# EAGLE design joypad (EAGLE 9.6.2)
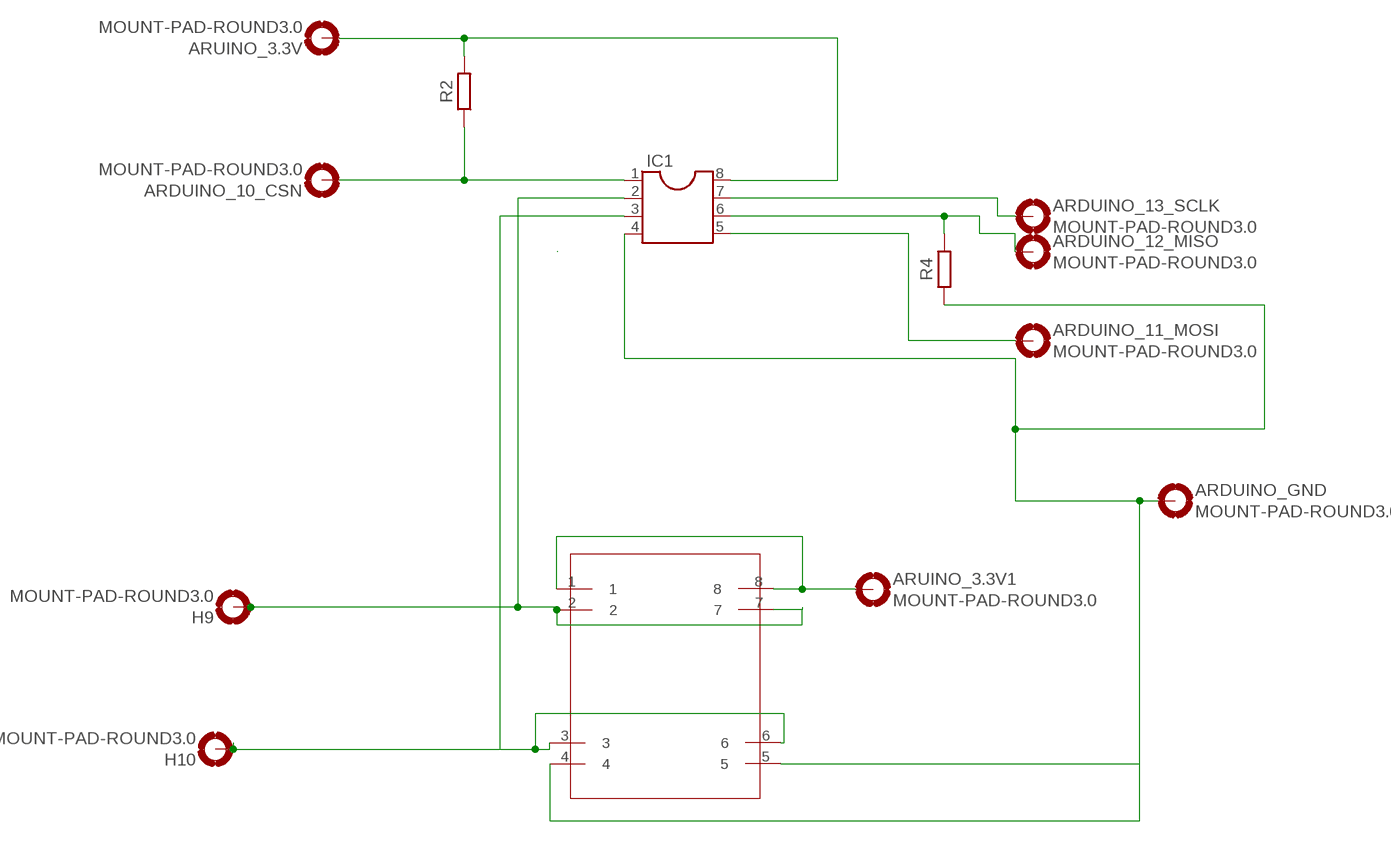
[diagram p0: schematic, sheet 1]

## Parts
ARDUINO_10_CSN  MOUNT-PAD-ROUND3.0  [3,0-PAD]
ARDUINO_11_MOSI  MOUNT-PAD-ROUND3.0  [3,0-PAD]
ARDUINO_12_MISO  MOUNT-PAD-ROUND3.0  [3,0-PAD]
ARDUINO_13_SCLK  MOUNT-PAD-ROUND3.0  [3,0-PAD]
ARDUINO_GND  MOUNT-PAD-ROUND3.0  [3,0-PAD]
ARUINO_3.3V  MOUNT-PAD-ROUND3.0  [3,0-PAD]
ARUINO_3.3V1  MOUNT-PAD-ROUND3.0  [3,0-PAD]
H9  MOUNT-PAD-ROUND3.0  [3,0-PAD]
H10  MOUNT-PAD-ROUND3.0  [3,0-PAD]
IC1  DIL8  [DIL08]
R2  R_AXIAL-7.2MM-PITCH  [RESAD724W46L381D178B]
R4  R_AXIAL-7.2MM-PITCH  [RESAD724W46L381D178B]
U$1  JOYSTICK  [JOYPAD]

## Nets
3.3V: ARUINO_3.3V.B3,0(MOUNT) IC1.8 R2.2
N$1: ARDUINO_10_CSN.B3,0(MOUNT) IC1.1 R2.1
N$4: ARDUINO_13_SCLK.B3,0(MOUNT) IC1.7
N$5: H10.B3,0(MOUNT) IC1.3 U$1.3 U$1.6
N$6: H9.B3,0(MOUNT) IC1.2 U$1.2 U$1.7
N$7: ARDUINO_12_MISO.B3,0(MOUNT) IC1.6 R4.2
N$8: ARDUINO_GND.B3,0(MOUNT) IC1.4 R4.1 U$1.4 U$1.5
N$9: ARDUINO_11_MOSI.B3,0(MOUNT) IC1.5
N$11: ARUINO_3.3V1.B3,0(MOUNT) U$1.1 U$1.8

## Library data of the parts
ARDUINO_10_CSN ARDUINO_11_MOSI ARDUINO_12_MISO ARDUINO_13_SCLK ARDUINO_GND ARUINO_3.3V ARUINO_3.3V1 H9 H10 = holes:MOUNT-PAD-ROUND: MOUNTING PAD, round
IC1 = ic-package:DIL8: Dual In Line / Socket
R2 R4 = Resistor:R: Resistor Fixed - Generic; CATEGORY: Resistor; SUB-CATEGORY: Fixed
U$1 = untitled:JOYSTICK

## Board
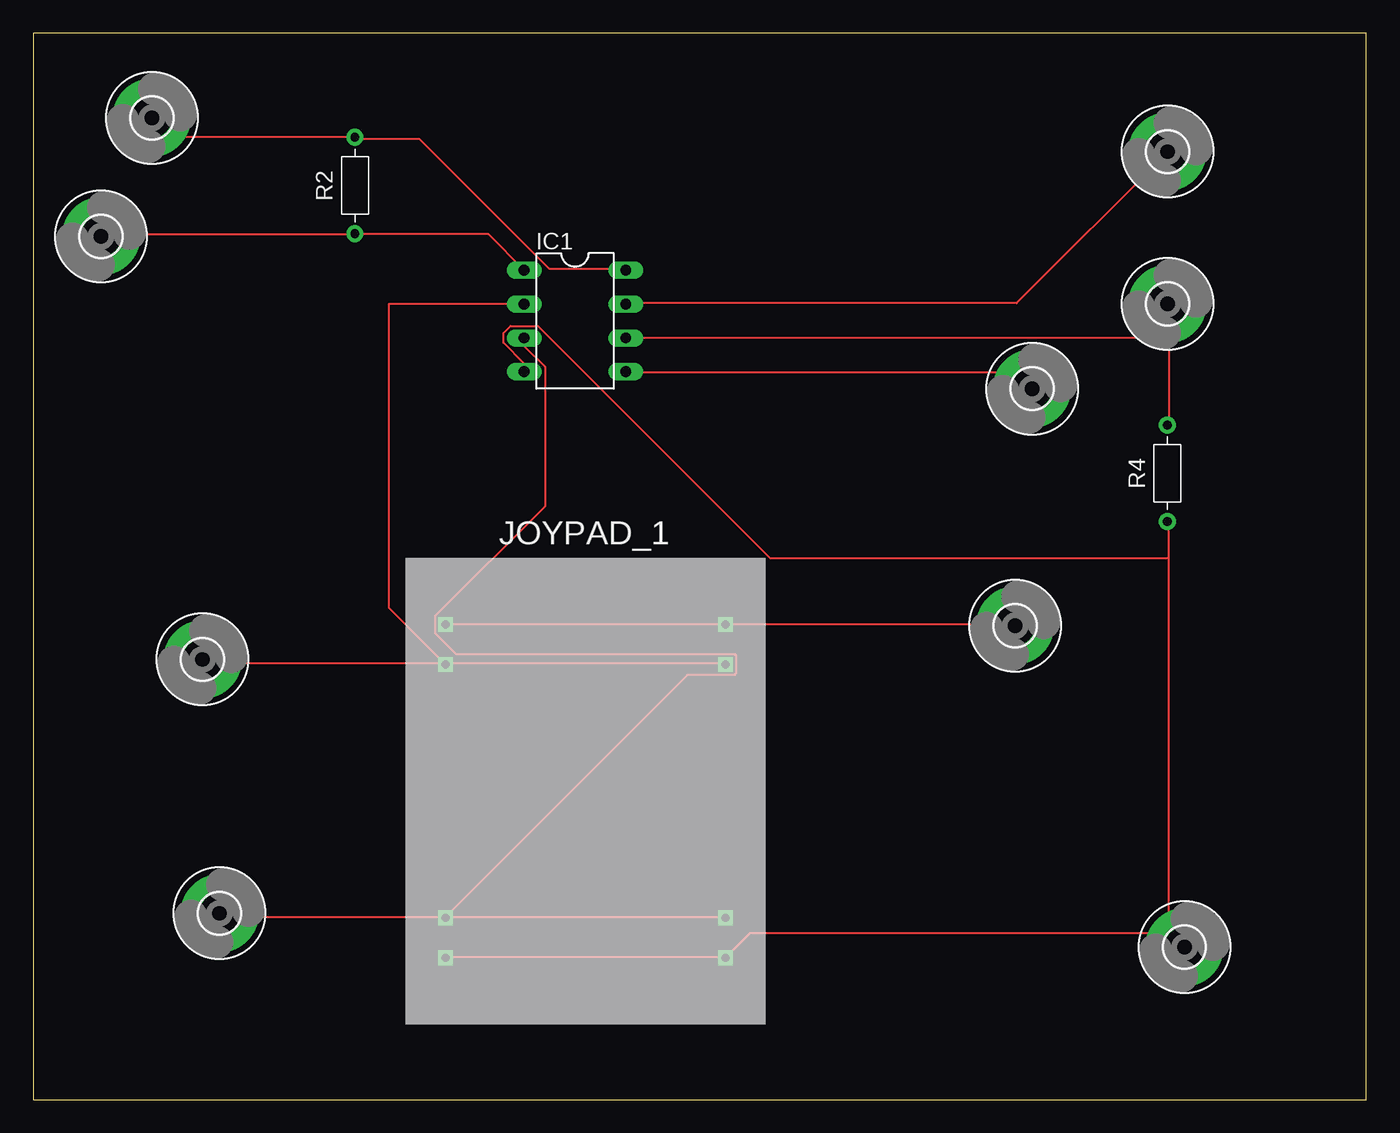
[diagram p1: board, top side]
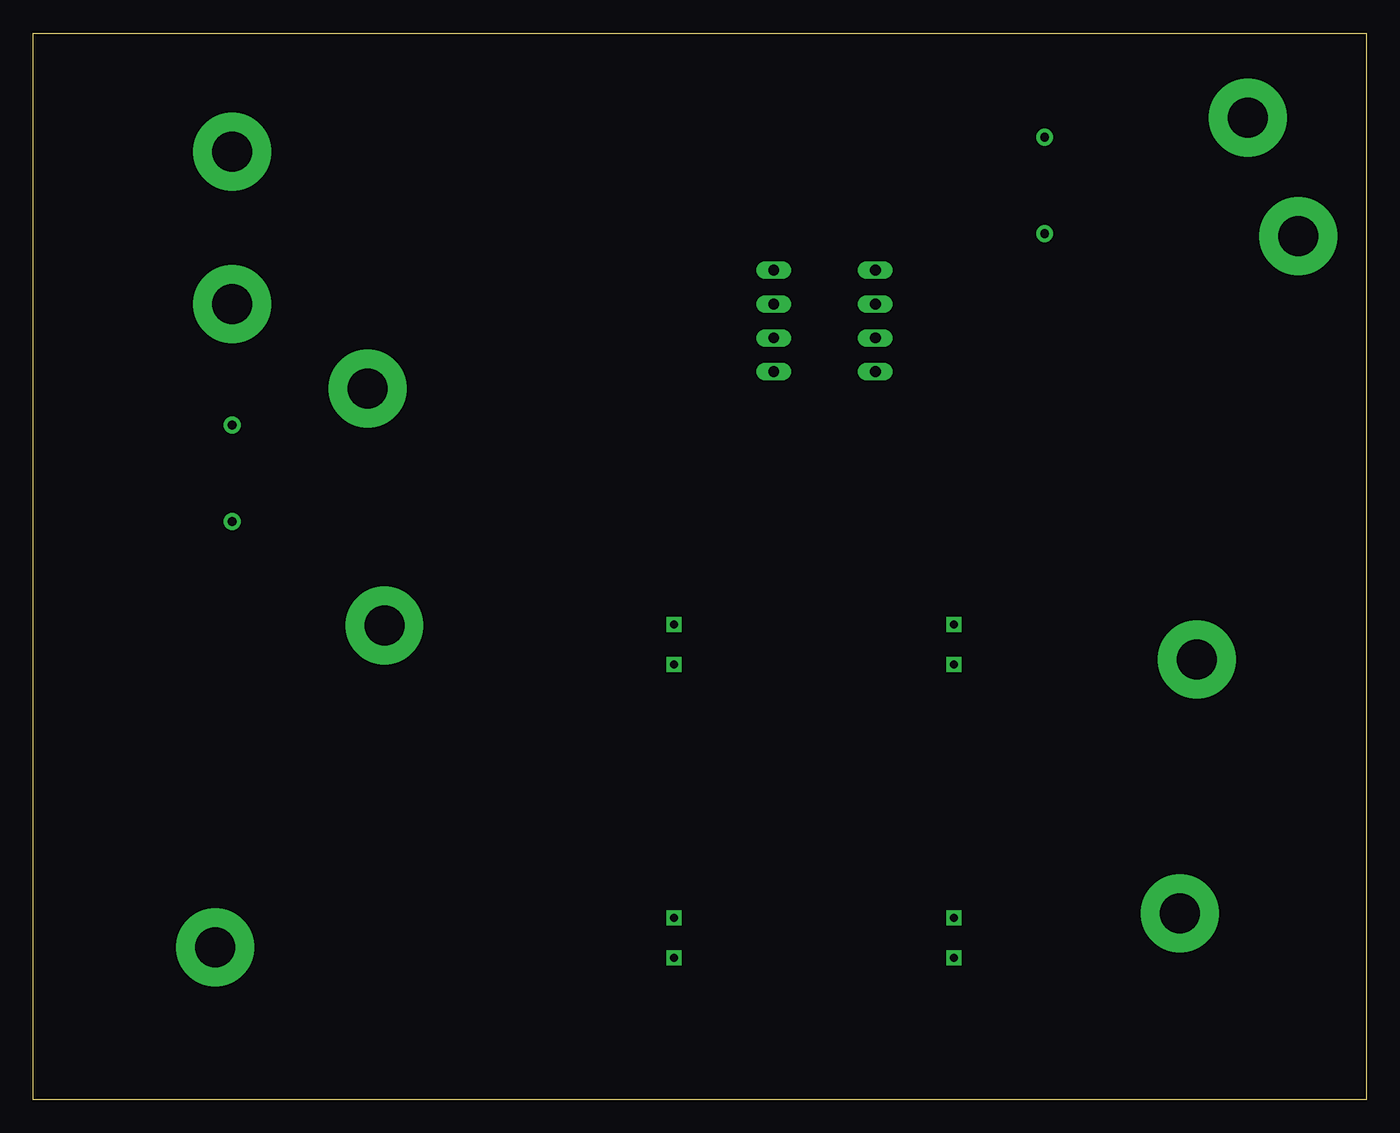
[diagram p2: board, bottom side, seen from below]

Size 100 x 80 mm. Coordinates in mm from the lower left corner, seen from the top.
Outline: 0,0 100,0 100,80 0,80 0,0
Copper layers (1*16): Top 0.035mm / dielectric 1.5mm / Bottom 0.035mm
Design rules "default": minimum track width 6mil, minimum drill 0.35mm, track to track 6mil, track to pad 6mil, pad to pad 6mil, via to via 6mil, smd to smd 6mil, copper to edge 40mil, drill to drill 6mil, minimum pad ring 10mil, minimum via ring 8mil, stop-mask expansion 4mil, vias tented up to drill 0mil, thermal gap 10mil

### Footprints (pad centres in the part's own frame; a part is rotated, then mirrored left to right if it is on the bottom)
3,0-PAD = drill 3 pad 5.842: B3,0 0,0
DIL08 = drill 0.813 long: 1 -3.81,-3.81; 2 -1.27,-3.81; 3 1.27,-3.81; 4 3.81,-3.81; 5 3.81,3.81; 6 1.27,3.81; 7 -1.27,3.81; 8 -3.81,3.81
RESAD724W46L381D178B = drill 0.66 pad 1.26: 1 -3.62,0; 2 3.62,0
JOYPAD = drill 0.6 square: 1 3,-5; 2 3,-8; 3 3,-27; 4 3,-30; 5 24,-30; 6 24,-27; 7 24,-8; 8 24,-5

### Placement (x,y rotation side)
ARDUINO_10_CSN  5.08,64.77 0 top
ARDUINO_11_MOSI  74.93,53.34 0 top
ARDUINO_12_MISO  85.09,59.69 0 top
ARDUINO_13_SCLK  85.09,71.12 0 top
ARDUINO_GND  86.36,11.43 0 top
ARUINO_3.3V  8.89,73.66 0 top
ARUINO_3.3V1  73.66,35.56 0 top
H9  12.7,33.02 0 top
H10  13.97,13.97 0 top
IC1  40.64,58.42 270 top
R2  24.13,68.58 90 top
R4  85.09,46.99 90 top
U$1  27.94,40.64 0 top

### Tracks (layer width: path | path; a pad name or v marks a point on that pad's centre or on a via)
3.3V
  Top 0.152: ARUINO_3.3V.B3,0 8.99,73.61 10.36,72.24 24.08,72.24 R2.2 24.23,72.08 28.96,72.08 38.71,62.33 44.35,62.33 IC1.8
N$1
  Top 0.152: IC1.1 34.14,64.92 24.23,64.92 R2.1 24.08,64.92 5.33,64.92 5.18,64.77 ARDUINO_10_CSN.B3,0
N$4
  Top 0.152: IC1.7 44.5,59.74 73.76,59.74 85.04,71.02 ARDUINO_13_SCLK.B3,0
N$5
  Top 0.152: 30.94,13.72 14.17,13.72 14.02,13.87 H10.B3,0 | 30.94,13.72 U$1.3 31.09,13.72 51.82,13.72 U$1.6 | IC1.3 36.83,56.53 38.38,54.98 38.38,44.51 30.16,36.29 30.16,34.99 31.73,33.42 52.59,33.42 52.72,33.29 52.72,31.99 52.59,31.86 49.08,31.86 30.94,13.72
  Bottom 0.152: 36.88,56.54 36.88,57.15 IC1.3 | 31.09,13.72 U$1.3
N$6
  Top 0.152: H9.B3,0 12.95,32.77 30.94,32.77 U$1.2 | U$1.7 51.82,32.77 31.09,32.77 U$1.2 | IC1.2 26.67,59.69 26.67,36.91 U$1.2
N$7
  Top 0.152: 85.19,57.15 85.19,59.59 ARDUINO_12_MISO.B3,0 85.19,57.15 | 85.19,57.15 85.19,50.7 R4.2 | 85.19,57.15 IC1.6
N$8
  Top 0.152: 85.19,12.5 85.19,40.54 | 85.19,40.54 85.19,43.23 R4.1 | 85.19,12.5 86.26,11.43 ARDUINO_GND.B3,0 85.19,12.5 | U$1.4 31.09,10.67 51.82,10.67 U$1.5 51.97,10.67 53.8,12.5 85.19,12.5 | IC1.4 36.83,55.23 35.28,56.78 35.28,57.52 35.8,58.04 37.86,58.04 55.26,40.64 85.09,40.64 85.19,40.54
  Bottom 0.152: 36.73,54.56 IC1.4 | 30.94,10.67 U$1.4
N$9
  Top 0.152: IC1.5 44.5,54.56 73.61,54.56 74.83,53.34 ARDUINO_11_MOSI.B3,0
N$11
  Top 0.152: U$1.1 31.09,35.66 51.82,35.66 U$1.8 51.97,35.66 73.61,35.66 ARUINO_3.3V1.B3,0